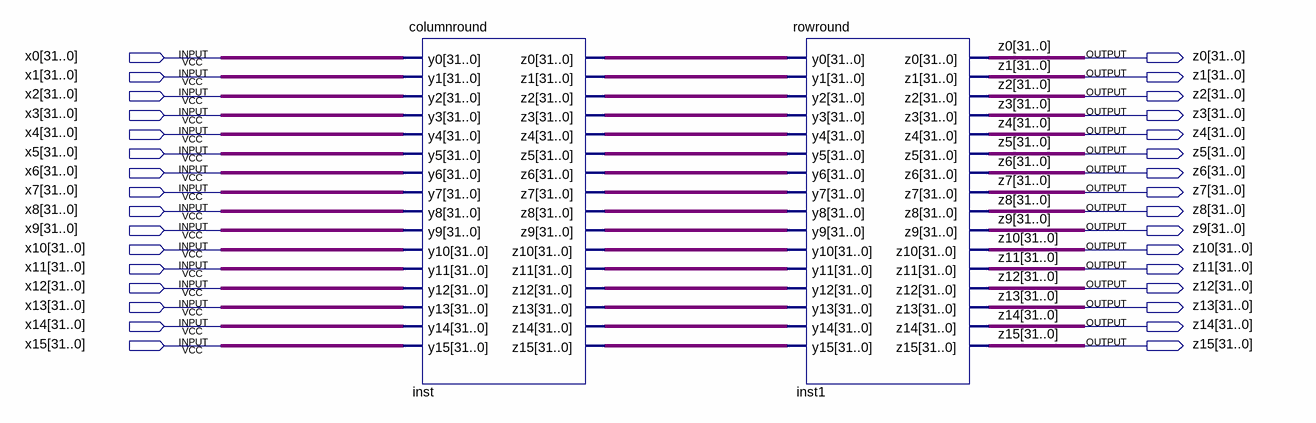
[diagram p0: schematic sheet]
// Quartus schematic doubleround.bdf as structural Verilog: 2 symbols, 32 pins
module doubleround (
  input  [31:0] x0,
  input  [31:0] x1,
  input  [31:0] x2,
  input  [31:0] x3,
  input  [31:0] x4,
  input  [31:0] x5,
  input  [31:0] x6,
  input  [31:0] x7,
  input  [31:0] x8,
  input  [31:0] x9,
  input  [31:0] x10,
  input  [31:0] x11,
  input  [31:0] x12,
  input  [31:0] x13,
  input  [31:0] x14,
  input  [31:0] x15,
  output [31:0] z0,
  output [31:0] z1,
  output [31:0] z2,
  output [31:0] z3,
  output [31:0] z4,
  output [31:0] z5,
  output [31:0] z6,
  output [31:0] z7,
  output [31:0] z8,
  output [31:0] z9,
  output [31:0] z10,
  output [31:0] z11,
  output [31:0] z12,
  output [31:0] z13,
  output [31:0] z14,
  output [31:0] z15
);

  wire [31:0] inst_z0, inst_z1, inst_z2, inst_z3, inst_z4, inst_z5, inst_z6, inst_z7, inst_z8, inst_z9,
       inst_z10, inst_z11, inst_z12, inst_z13, inst_z14, inst_z15;

  columnround inst (
    .y0(x0), .y1(x1), .y2(x2), .y3(x3), .y4(x4), .y5(x5), .y6(x6), .y7(x7), .y8(x8), .y9(x9), .y10(x10),
    .y11(x11), .y12(x12), .y13(x13), .y14(x14), .y15(x15), .z0(inst_z0), .z1(inst_z1), .z2(inst_z2),
    .z3(inst_z3), .z4(inst_z4), .z5(inst_z5), .z6(inst_z6), .z7(inst_z7), .z8(inst_z8), .z9(inst_z9),
    .z10(inst_z10), .z11(inst_z11), .z12(inst_z12), .z13(inst_z13), .z14(inst_z14), .z15(inst_z15));
  rowround inst1 (
    .y0(inst_z0), .y1(inst_z1), .y2(inst_z2), .y3(inst_z3), .y4(inst_z4), .y5(inst_z5), .y6(inst_z6),
    .y7(inst_z7), .y8(inst_z8), .y9(inst_z9), .y10(inst_z10), .y11(inst_z11), .y12(inst_z12), .y13(inst_z13),
    .y14(inst_z14), .y15(inst_z15), .z0(z0), .z1(z1), .z2(z2), .z3(z3), .z4(z4), .z5(z5), .z6(z6), .z7(z7),
    .z8(z8), .z9(z9), .z10(z10), .z11(z11), .z12(z12), .z13(z13), .z14(z14), .z15(z15));
endmodule
